# EAGLE design SparkFun_Cypress_USBUART_BOB (EAGLE 7.5.0)
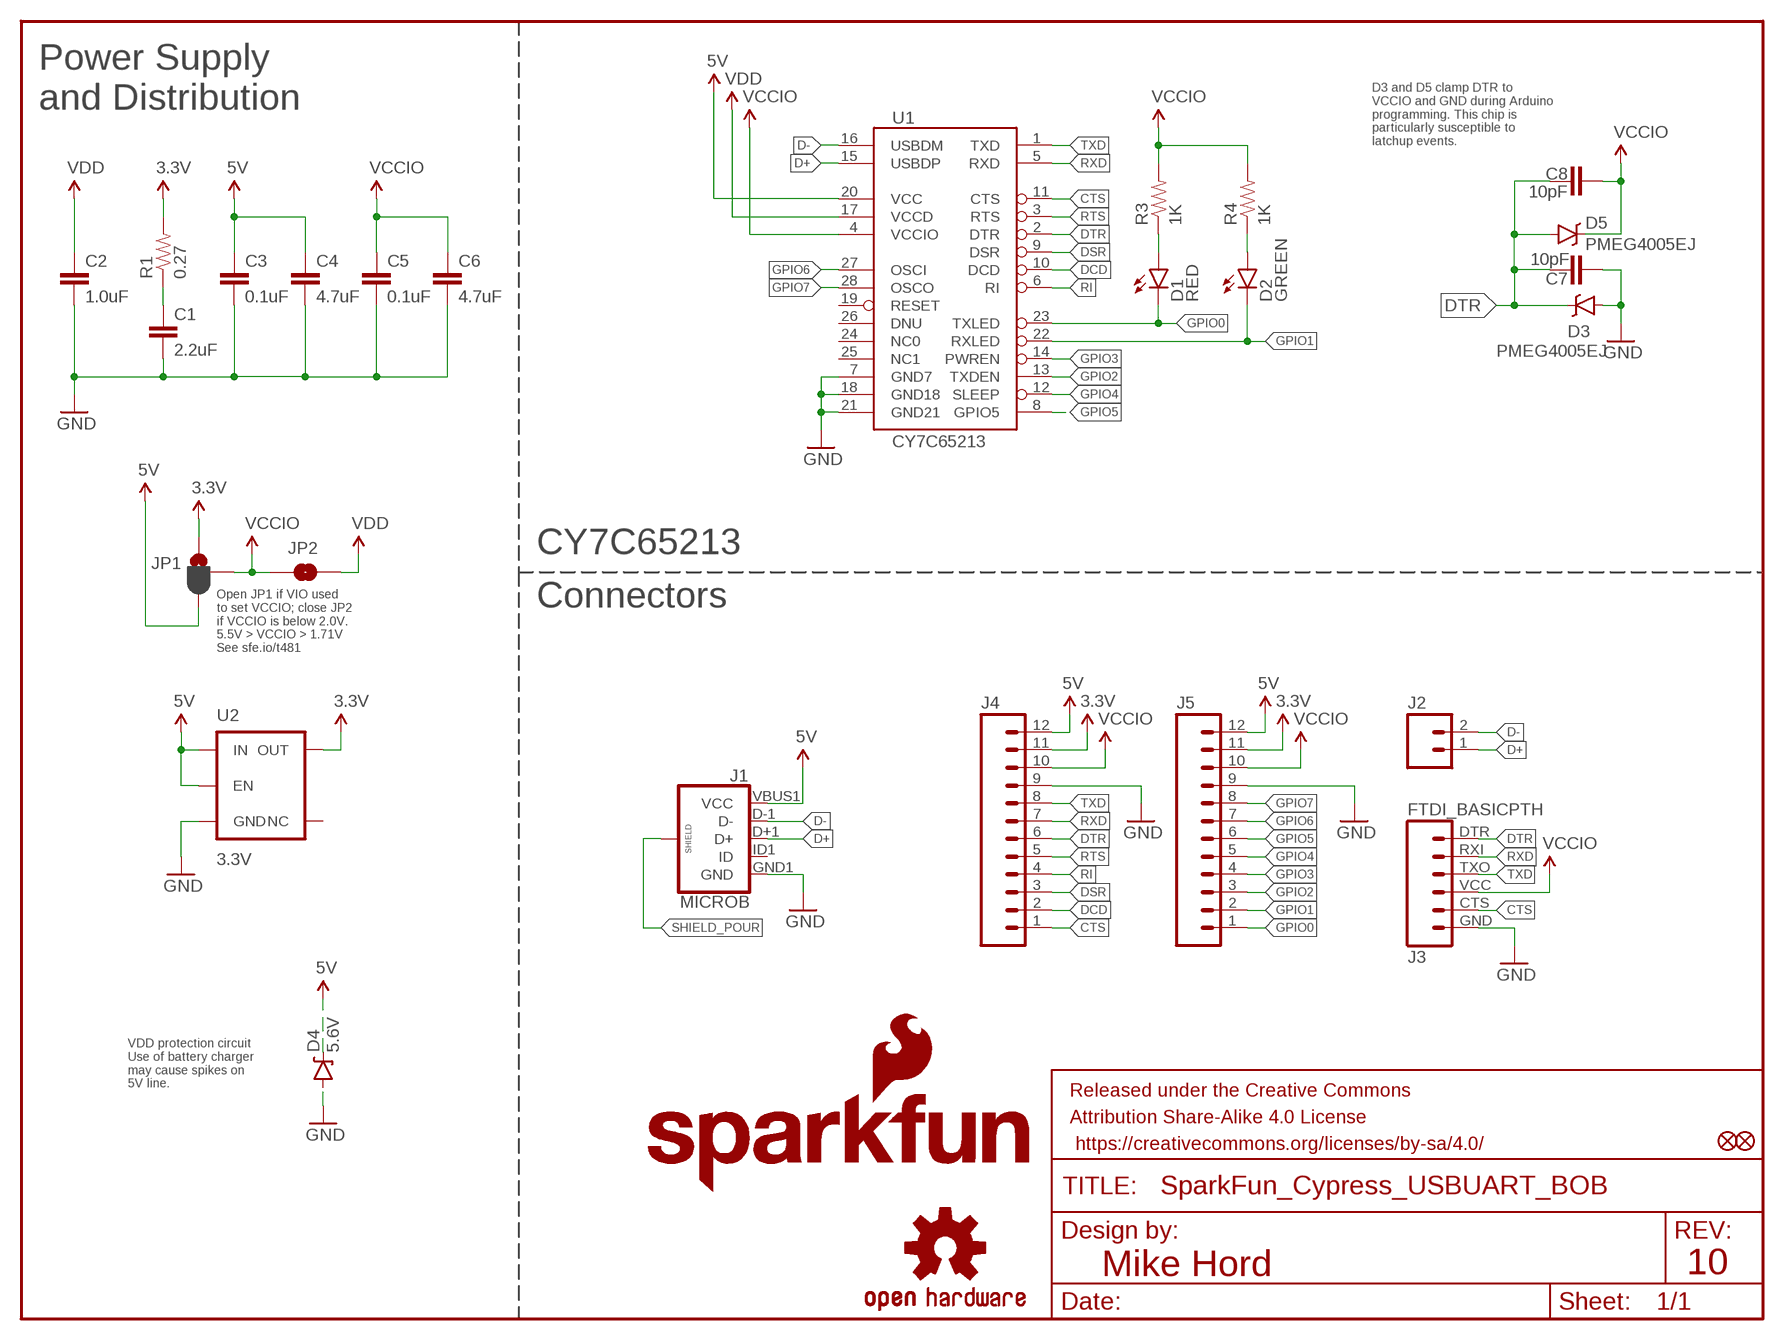
[diagram p0: schematic, sheet 1]

## Parts
C1  2.2uF  2.2UF-10V-20%(0603)  [0603-CAP]
C2  1.0uF  1.0UF-16V-10%(0603)  [0603-CAP]
C3  0.1uF  0.1UF-25V-5%(0603)  [0603-CAP]
C4  4.7uF  4.7UF-16V-20%,+80%-(1206)  [1206-CAP]
C5  0.1uF  0.1UF-25V-5%(0603)  [0603-CAP]
C6  4.7uF  4.7UF-16V-20%,+80%-(1206)  [1206-CAP]
C7  10pF  10PF-50V-5%(0603)  [0603-CAP]
C8  10pF  10PF-50V-5%(0603)  [0603-CAP]
D1  RED  LED-RED0603  [LED-0603]
D2  GREEN  LED-GREEN0603  [LED-0603]
D3  PMEG4005EJ  DIODE-SCHOTTKY-PMEG4005EJ  [SOD-323]
D4  5.6V  DIODE-ZENER5.6V  [SOD-323]
D5  PMEG4005EJ  DIODE-SCHOTTKY-PMEG4005EJ  [SOD-323]
FD1  FIDUCIALUFIDUCIAL  [MICRO-FIDUCIAL]
FD2  FIDUCIALUFIDUCIAL  [MICRO-FIDUCIAL]
FRAME1  FRAME-LETTER  [CREATIVE_COMMONS]
J1  MICROB  USB_MICROB_PLUGCONN-11752  [USB-B-MICRO-SMD_V03]
J2  M02PTH  [1X02]
J3  FTDI_BASICPTH  [FTDI_BASIC]
J4  M12PTH  [1X12]
J5  M12PTH  [1X12]
JP1  JUMPER-PAD-3-2OF3_NC_BY_PASTE  [PAD-JUMPER-3-2OF3_NC_BY_PASTE_YES_SILK_FULL_BOX]
JP2  JUMPER-PAD-2-NOYES_SILK  [PAD-JUMPER-2-NO_YES_SILK]
LOGO1  SFE_LOGO_NAME_FLAME.1_INCH  [SFE_LOGO_NAME_FLAME_.1]
LOGO2  OSHW-LOGOS  [OSHW-LOGO-S]
R1  0.27  0.27OHM-1/10W-1%(0603)  [0603-RES]
R3  1K  1KOHM-1/10W-1%(0603)  [0603-RES]
R4  1K  1KOHM-1/10W-1%(0603)  [0603-RES]
U1  CY7C65213  [SSOP28DB]
U2  3.3V  V_REG_AP2112K-3.3V  [SOT23-5]

## Nets
3.3V: J4.11 J5.11 JP1.1 R1.2 U2.5(OUT)
5V: C3.1 C4.1 D4.C J1.VBUS1(VCC) J4.12 J5.12 JP1.3 U1.20(VCC) U2.1(IN) U2.3(EN)
CTS: J3.CTS J4.1 U1.11(CTS)
D+: J1.D+1(D+) J2.1 U1.15(USBDP)
D-: J1.D-1(D-) J2.2 U1.16(USBDM)
DCD: J4.2 U1.10(DCD)
DSR: J4.3 U1.9(DSR)
DTR: C7.1 C8.1 D3.C D5.A J3.DTR J4.6 U1.2(DTR)
GND: C1.2 C2.2 C3.2 C4.2 C5.2 C6.2 C7.2 D3.A D4.A J1.GND1(GND) J3.GND J4.9 J5.9 U1.7(GND7) U1.18(GND18) U1.21(GND21) U2.2(GND)
GPIO0: D1.C J5.1 U1.23(TXLED)
GPIO1: D2.C J5.2 U1.22(RXLED)
GPIO2: J5.3 U1.13(TXDEN)
GPIO3: J5.4 U1.14(PWREN)
GPIO4: J5.5 U1.12(SLEEP)
GPIO5: J5.6 U1.8(GPIO5)
GPIO6: J5.7 U1.27(OSCI)
GPIO7: J5.8 U1.28(OSCO)
N$1: C1.1 R1.1
N$2: D2.A R4.1
N$3: D1.A R3.1
RI: J4.4 U1.6(RI)
RTS: J4.5 U1.3(RTS)
RXD: J3.RXI J4.7 U1.5(RXD)
SHIELD_POUR: J1.SHIELD1(SHIELD) J1.SHIELD2(SHIELD) J1.SHIELD3(SHIELD)
TXD: J3.TXO J4.8 U1.1(TXD)
VCCIO: C5.1 C6.1 C8.2 D5.C J3.VCC J4.10 J5.10 JP1.2 JP2.1 R3.2 R4.2 U1.4(VCCIO)
VDD: C2.1 JP2.2 U1.17(VCCD)
Unconnected: J1.ID1(ID) U1.19(RESET) U1.24(NC0) U1.26(DNU) U2.4(NC)

## Notes on the sheet
- Power Supply
  and Distribution
- D3 and D5 clamp DTR to
  VCCIO and GND during Arduino
  programming. This chip is
  particularly susceptible to
  latchup events.
- CY7C65213
- Connectors
- Open JP1 if VIO used 
  to set VCCIO; close JP2
  if VCCIO is below 2.0V.
  5.5V > VCCIO > 1.71V
  See sfe.io/t481
- VDD protection circuit
  Use of battery charger
  may cause spikes on 
  5V line.
- Mike Hord | 10

## Power pins joined to a net without a drawn wire
NC1: U1.25(NC1)

## Library data of the parts
C1 = SparkFun-Capacitors:2.2UF-10V-20%(0603): CAP-07888; PROD_ID: CAP-07888
C2 = SparkFun-Capacitors:1.0UF-16V-10%(0603): CAP-00868; PROD_ID: CAP-00868
C3 C5 = SparkFun-Capacitors:0.1UF-25V-5%(0603): CAP-08604; PROD_ID: CAP-08604
C4 C6 = SparkFun-Capacitors:4.7UF-16V-20%,+80%-(1206): CAP-10300; PROD_ID: CAP-10300
C7 C8 = SparkFun-Capacitors:10PF-50V-5%(0603): CAP-11812; PROD_ID: CAP-11812
D1 = SparkFun-LED:LED-RED: Assorted Red LEDs LilyPad 1206- DIO-09912 1206- DIO-00809 0603- DIO-00819 "SMART" means more efficient and expensive; PROD_ID: DIO-00819
D2 = SparkFun-LED:LED-GREEN: Various green LEDs Green LEDs used in SFE Production 0603- DIO-00821 LARGE- DIO-00862 LILYPAD- DIO-09910; PROD_ID: DIO-00821
D3 D5 = SparkFun-DiscreteSemi:DIODE-SCHOTTKY: Schottky diodes in SFE's production catalog BAT20J 1A 23V 0.62Vf RB751 120mA 40V 0.37Vf PMEG4005EJ 0.5A 40V 0.42Vf MBRA140 1A 40V 0.5Vf B340A 3A 40V SMA; PROD_ID: DIO-10955
D4 = SparkFun-DiscreteSemi:DIODE-ZENER: Zener Diode Production Part - 8199 3.4V Zener Voltage; PROD_ID: DIO-12442
FD1 FD2 = SparkFun-Aesthetics:FIDUCIAL: Fiducial Alignment Points Various fiducial points for machine vision alignment.
FRAME1 = SparkFun-Aesthetics:FRAME-LETTER: Schematic Frame Standard 8.5x11 US Letter frame
J1 = SparkFun-Connectors:USB_MICROB_PLUG: USB Micro-B connectors Some male, some female. Watch your step!; PROD_ID: CONN-11752
J2 = SparkFun-Connectors:M02: Standard 2-pin 0.1" header. Use with - straight break away headers ( PRT-00116) - right angle break away headers (PRT-00553) - swiss pins (PRT-00743) - machine pins (PRT-00117) - female headers (PRT-00115) Molex polarized connector foot print use with: PRT-08233 with associated crimp pins and housings. 2.54_SCREWTERM for use with PRT-10571. 3.5mm Screw Terminal footprints for PRT-08084 5mm Screw Terminal footprints for use with PRT-08432
J3 = SparkFun-Connectors:FTDI_BASIC: FTDI Basic header with labels
J4 J5 = SparkFun-Connectors:M12: Header 12 Standard 12-pin 0.1" header. Use with straight break away headers (SKU : PRT-00116), right angle break away headers (PRT-00553), swiss pins (PRT-00743), machine pins (PRT-00117), and female headers (PRT-00115).
JP1 = SparkFun-Passives:JUMPER-PAD-3-2OF3_NC_BY_PASTE
JP2 = SparkFun-Passives:JUMPER-PAD-2-NO
LOGO1 = SparkFun-Aesthetics:SFE_LOGO_NAME_FLAME: SFE Logo, name and flame This is the SparkFun full logo. The logo on the schematic will always be the same size; the package variant is the height of the flame part of the logo. Default layer for the logo on the board is tSilk.
LOGO2 = SparkFun-Aesthetics:OSHW-LOGO: Open Source Hardware Logo This logo indicates the piece of hardware it is found on incorporates a OSHW license and/or adheres to the definition of open source hardware found here: http://freedomdefined.org/OSHW
R1 = SparkFun-Resistors:0.27OHM-1/10W-1%(0603): RES-08787; PROD_ID: RES-08787
R3 R4 = SparkFun-Resistors:1KOHM-1/10W-1%(0603): RES-07856; PROD_ID: RES-07856
U1 = SparkFun-DigitalIC:CY7C65213: USB UART CY7C65213 USB-UART controller.; PROD_ID: IC-12487
U2 = SparkFun-PowerIC:V_REG_AP2112: AP2112 - 600mA CMOS LDO Regulator w/ Enable The AP2112 is CMOS process low dropout linear regulator with enable function, the regulator delivers a guaranteed 600mA (min.) continuous load current. Features Output Voltage Accuracy: ±1.5% Output Current: 600mA (Min.) Foldback Short Current Protection: 50mA Enable Function to Turn ON/OFF VOUT Low Dropout Voltage (3.3V): 250mV (Typ.) @IOUT=600mA Excellent Load Regulation: 0.2%/A (Typ.) Excellent Line Regulation: 0.02%/V (Typ.) Low Quiescent Current: 55μA (Typ.) Low Standby Current: 0.01μA (Typ.) Low Output Noise: 50μVRMS PSRR: 100Hz -65dB, 1kHz -65dB OTSD Protection Stable with 1.0μF Flexible Cap: Ceramic, Tantalum and Aluminum Electrolytic Operation Temperature Range: -40°C to 85°C ESD: MM 400V, HBM 4000V; PROD_ID: VREG-12457

## Board
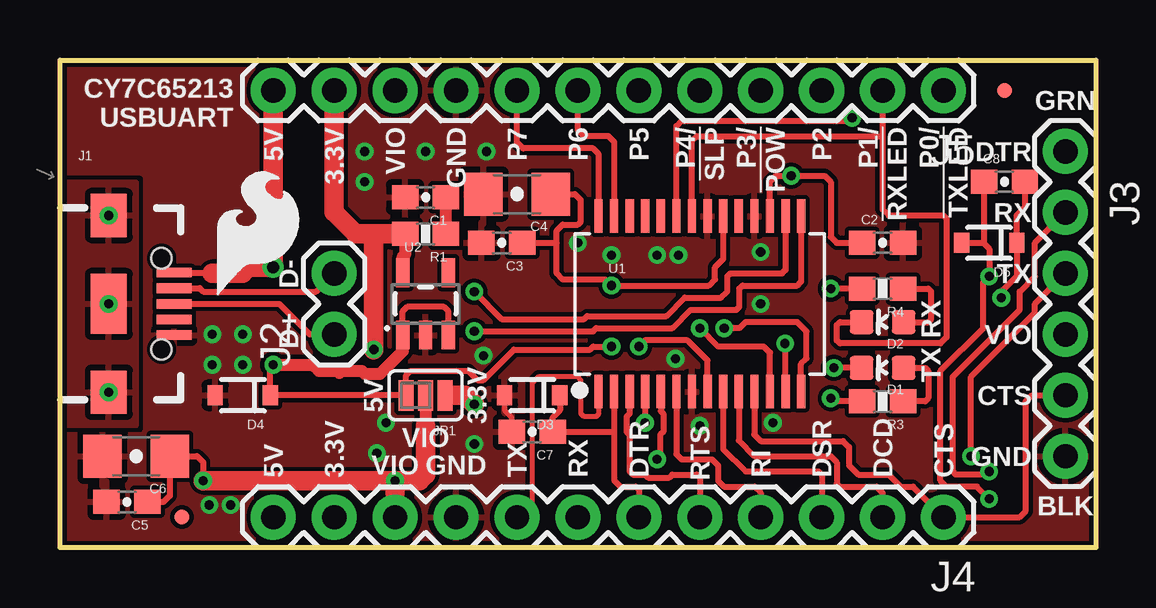
[diagram p1: board, top side]
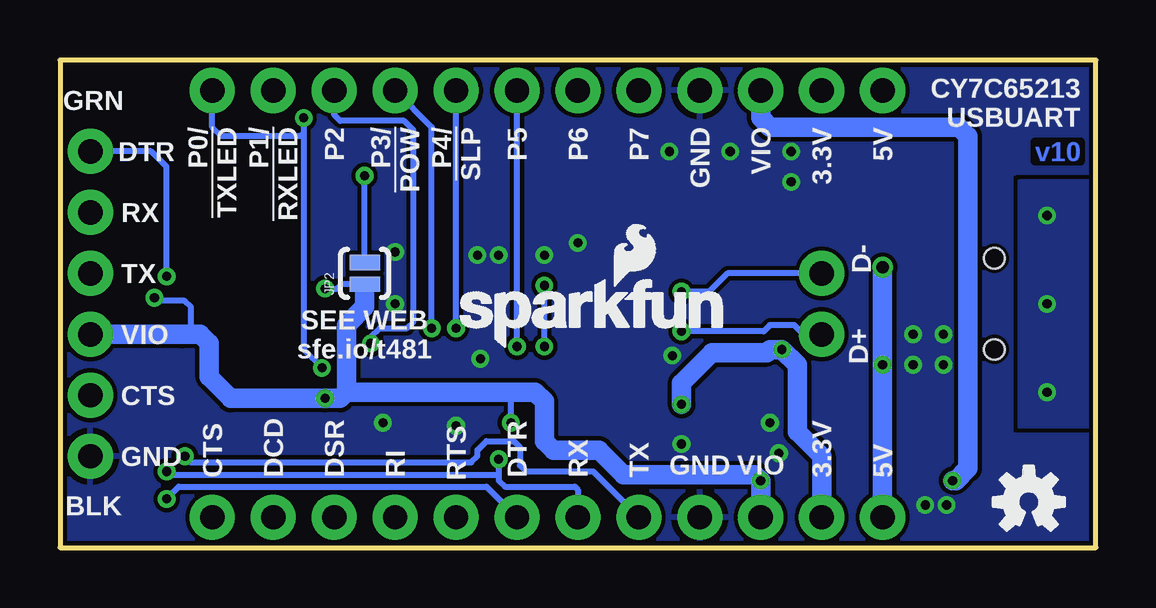
[diagram p2: board, bottom side, seen from below]

Size 43.18 x 20.32 mm. Coordinates in mm from the lower left corner, seen from the top.
Outline: 0,0 0,20.32 43.18,20.32 43.18,0 0,0
Copper layers (1*16): Top 0.035mm / dielectric 1.5mm / Bottom 0.035mm
Design rules "SparkFun-2-layer-TIGHT": minimum track width 7mil, minimum drill 15mil, track to track 7mil, track to pad 7mil, pad to pad 7mil, via to via 7mil, smd to smd 7mil, copper to edge 7mil, drill to drill 7mil, minimum pad ring 7mil, minimum via ring 7mil, stop-mask expansion 4mil, vias tented up to drill 20mil, thermal gap 10mil

### Footprints (pad centres in the part's own frame; a part is rotated, then mirrored left to right if it is on the bottom)
0603-CAP = smd 1.1 x 1: 1 -0.85,0; 2 0.85,0
1206-CAP = smd 1.6 x 1.8: 1 -1.4,0; 2 1.4,0
LED-0603 = smd 1 x 1: A 0,-0.877; C 0,0.877
SOD-323 = smd 0.63 x 0.83: A 1.15,0; C -1.15,0
MICRO-FIDUCIAL = smd 0.635 x 0.635: 1 0,0
USB-B-MICRO-SMD_V03 = smd 1.45 x 0.4: D+1 2.725,0; D-1 2.725,0.65; GND1 2.725,-1.3; ID1 2.725,-0.65; VBUS1 2.725,1.3 | smd 1.5 x 1.8: SHIELD1 0,3.685; SHIELD2 0,-3.685 | smd 1.5 x 2.5: SHIELD3 0,0 | hole 0.85: 2.2,1.9; 2.2,-1.9
1X02 = drill 1.016 pad 1.88: 1 0,0; 2 2.54,0
FTDI_BASIC = drill 1.016 pad 1.88: CTS 10.16,0; DTR 0,0; GND 12.7,0; RXI 2.54,0; TXO 5.08,0; VCC 7.62,0
1X12 = drill 1.016 pad 1.88: 1 0,0; 2 2.54,0; 3 5.08,0; 4 7.62,0; 5 10.16,0; 6 12.7,0; 7 15.24,0; 8 17.78,0; 9 20.32,0; 10 22.86,0; 11 25.4,0; 12 27.94,0
PAD-JUMPER-3-2OF3_NC_BY_PASTE_YES_SILK_FULL_BOX = smd 0.635 x 1.27: 1 -0.813,0; 2 0,0; 3 0.813,0
PAD-JUMPER-2-NO_YES_SILK = smd 0.635 x 1.27: 1 -0.45,0; 2 0.45,0
0603-RES = smd 1.1 x 1: 1 -0.85,0; 2 0.85,0
SSOP28DB = smd 0.348 x 1.397: 1 -4.225,-3.656; 2 -3.575,-3.656; 3 -2.925,-3.656; 4 -2.275,-3.656; 5 -1.625,-3.656; 6 -0.975,-3.656; 7 -0.325,-3.656; 8 0.325,-3.656; 9 0.975,-3.656; 10 1.625,-3.656; 11 2.275,-3.656; 12 2.925,-3.656; 13 3.575,-3.656; 14 4.225,-3.656; 15 4.225,3.656; 16 3.575,3.656; 17 2.925,3.656; 18 2.275,3.656; 19 1.625,3.656; 20 0.975,3.656; 21 0.325,3.656; 22 -0.325,3.656; 23 -0.975,3.656; 24 -1.625,3.656; 25 -2.275,3.656; 26 -2.925,3.656; 27 -3.575,3.656; 28 -4.225,3.656
SOT23-5 = smd 0.55 x 1.2: 1 -0.95,-1.3; 2 0,-1.3; 3 0.95,-1.3; 4 0.95,1.3; 5 -0.95,1.3

### Placement (x,y rotation side)
C1  15.24,14.61 180 top
C2  34.29,12.7 0 top
C3  18.41,12.7 180 top
C4  19.05,14.73 180 top
C5  2.79,1.91 180 top
C6  3.17,3.81 180 top
C7  19.68,4.83 180 top
C8  39.37,15.24 0 top
D1  34.29,7.49 90 top
D2  34.29,9.4 90 top
D3  19.68,6.35 180 top
D4  7.62,6.35 180 top
D5  38.73,12.7 180 top
FD1  5.08,1.27 0 top
FD2  39.37,19.05 0 top
FRAME1  24.13,-17.78 0 top  (outside the outline)
J1  2.03,10.16 0 top
J2  11.43,8.89 90 top
J3  41.91,16.51 270 top
J4  36.83,1.27 180 top
J5  36.83,19.05 180 top
JP1  15.24,6.35 180 top
JP2  30.48,11.43 90 bottom
LOGO1  26.92,8.26 0 bottom
LOGO2  2.79,1.91 0 bottom
LOGO5  SFE_LOGO_FLAME.2_INCH  [SFE_LOGO_FLAME_.2]  6.22,10.29 0 top
R1  15.24,13.08 180 top
R3  34.29,6.1 180 top
R4  34.29,10.79 180 top
U1  26.67,10.16 0 top
U2  15.24,10.16 0 top

### Tracks (layer width: path | path; a pad name or v marks a point on that pad's centre or on a via)
3.3V  (via drill 0.38)
  Top 0.508: JP1.1 16.38,6.35 | U2.5 14.29,12.13 14.39,12.23 R1.2 13.84,13.08
  Top 0.813: 16.38,6.35 16.89,6.35 v17.27,5.97 | v13.08,8.26 13.08,13.08 | J5.11 11.43,13.97 12.32,13.08 13.08,13.08 | 13.84,13.08 13.08,13.08
  Bottom 0.813: v17.27,5.97 17.27,6.86 16,8.13 13.72,8.13 13.59,8.26 v13.08,8.26 12.45,7.62 12.45,4.83 11.43,3.81 J4.11
5V  (via drill 0.38, 0.51)
  Top 0.254: J1.VBUS1 6.32,11.46 6.35,11.43 | U2.3 16.19,9.85 16,10.03 14.48,10.03 14.29,9.85 U2.1 | v22.99,8.38 22.23,8.38 22.1,8.26 18.92,8.26 17.65,6.99 17.4,6.99 17.02,7.37 14.61,7.37 14.43,7.19 JP1.3 D4.C 8.77,7.5 v8.89,7.62 | 20.7,12.7 20.7,11.43 20.96,11.17 22.74,11.17 v22.99,10.92 27.05,10.92 27.3,11.18 27.3,11.68 27.64,12.02 U1.20 | 20.7,12.7 20.7,13.21 20.95,13.46 21.59,13.46 21.72,13.59 21.72,14.48 21.46,14.73 C4.1 | C3.1 20.7,12.7
  Top 0.508: v8.89,7.62 10.54,7.62 10.79,7.37 11.56,7.37 | 11.56,7.37 12.57,7.37 12.7,7.24 13.34,7.24 14.29,8.19 U2.1 | 11.64,7.28 11.56,7.37
  Top 0.813: J5.12 v8.89,11.68 7.87,11.68 7.62,11.43 6.35,11.43
  Bottom 0.254: v22.99,8.38 v22.99,10.92
  Bottom 0.813: v8.89,11.68 v8.89,7.62 J4.12
CTS
  Top 0.254: U1.11 28.95,4.71 29.21,4.45 32.64,4.45 32.89,4.19 32.89,3.43 33.27,3.05 34.54,3.05 35.05,2.54 35.56,2.54 J4.1 40.01,1.27 40.26,1.52 40.26,6.1 40.51,6.35 J3.CTS
D+  (via drill 0.38)
  Top 0.254: J1.D+1 9.14,10.16 10.41,8.89 J2.1 | v17.27,9.02 22.23,9.02 22.35,9.14 25.53,9.14 26.29,9.91 28.19,9.91 28.32,10.03 28.32,10.79 28.45,10.92 30.73,10.92 30.89,11.08 U1.15
  Bottom 0.254: J2.1 12.19,8.89 12.57,9.27 13.59,9.27 13.84,9.02 v17.27,9.02
D-  (via drill 0.38)
  Top 0.254: J1.D-1 5.83,10.81 5.97,10.67 10.67,10.67 J2.2 | v17.27,10.67 18.41,9.53 21.84,9.53 21.97,9.65 25.27,9.65 26.04,10.41 27.56,10.41 27.81,10.67 27.81,11.3 27.94,11.43 30.1,11.43 30.25,11.58 U1.16
  Bottom 0.254: J2.2 15.37,11.43 16.13,10.67 v17.27,10.67
DCD
  Top 0.254: U1.10 28.3,4.47 28.96,3.81 32.13,3.81 32.38,3.56 32.38,2.67 32.51,2.54 34.04,2.54 34.29,2.29 J4.2
DSR
  Top 0.254: U1.9 27.64,4.11 28.57,3.17 31.62,3.17 31.75,3.05 J4.3
DTR  (via drill 0.38)
  Top 0.254: U1.2 23.09,4.83 | 23.09,4.83 23.09,2.81 23.37,2.54 24,2.54 24.13,2.41 J4.6 | v38.73,2.03 38.23,2.54 36.96,2.54 36.7,2.79 36.7,7.37 38.48,9.14 38.48,11.05 v38.73,11.3 38.73,12.45 38.48,12.7 | 23.09,4.83 C7.1 20.54,5.42 20.84,5.72 D3.C | D5.A 38.48,12.7 | C8.1 38.52,12.74 38.48,12.7
  Bottom 0.254: J4.6 25.4,2.54 38.23,2.54 v38.73,2.03 | v38.73,11.3 38.73,15.88 39.37,16.51 J3.DTR
GND  (via drill 0.38)
  Top 0.203: C7.2 18.84,5.42 18.54,5.71 18.54,6.22
  other vias: 6.35,8.89 6.35,7.62 7.62,8.89 7.62,7.62 17.27,4.32 26.67,5.08 29.21,12.32 29.21,10.16 12.7,16.51 17.65,8 13.59,5.21 13.21,3.94 29.72,5.21 25.65,7.87 7.11,1.78 6.22,1.78 12.7,15.24 15.24,16.51 17.78,16.51 21.59,12.7 22.99,12.19 24.89,12.19 25.78,12.19
  pour Bottom (rank 2): 0,20.32 0,0 43.18,0 43.18,20.32
  pour Top (rank 2): 0,20.32 0,0 43.18,0 43.18,20.32
GPIO0  (via drill 0.38)
  Top 0.254: U1.23 25.7,17.57 25.91,17.78 32.89,17.78 v33.02,17.91 | D1.C v32.26,7.49
  Bottom 0.254: J5.1 36.83,17.53 36.45,17.14 33.15,17.14 33.02,17.27 | v33.02,17.91 33.02,17.27 | 33.02,17.27 33.02,8.26 v32.26,7.49
GPIO1
  Top 0.254: U1.22 26.34,16.95 26.54,17.14 34.29,17.14 | J5.2 34.29,17.14 | 34.29,17.14 34.29,14.1 34.54,13.84 36.83,13.84 36.96,13.72 36.96,8.76 36.7,8.51 32.51,8.51 32.38,8.64 32.38,9.27 32.51,9.4 D2.C
GPIO2  (via drill 0.38)
  Top 0.254: U1.13 30.25,8.49 v30.23,8.51
  Bottom 0.254: v30.23,8.51 30.23,8.76 29.84,9.14 28.7,9.14 28.45,9.4 28.45,17.4 28.83,17.78 31.5,17.78 31.75,18.03 J5.3
GPIO3  (via drill 0.38)
  Top 0.254: v27.69,9.14 28.32,9.14 28.57,9.4 30.73,9.4 31.11,9.02 31.11,7.87 30.89,7.65 U1.14
  Bottom 0.254: v27.69,9.14 27.69,17.53 J5.4
GPIO4  (via drill 0.38)
  Top 0.254: U1.12 29.59,8.12 29.34,8.38 27.43,8.38 v26.67,9.14
  Bottom 0.254: v26.67,9.14 J5.5
GPIO5  (via drill 0.38)
  Top 0.254: U1.8 27,7.8 26.16,8.64 24.38,8.64 v24.13,8.38
  Bottom 0.254: v24.13,8.38 J5.6
GPIO6
  Top 0.254: J5.7 21.59,17.4 21.84,17.14 22.86,17.14 23.09,16.91 U1.27
GPIO7
  Top 0.254: J5.8 19.05,16.89 19.3,16.64 22.23,16.64 22.45,16.42 U1.28
N$1
  Top 0.508: R1.1 C1.1
N$2
  Top 0.254: D2.A 36.2,9.4 36.32,9.53 36.32,10.67 36.2,10.79 R4.1
N$3
  Top 0.254: D1.A 36.07,7.49 36.2,7.37 36.2,6.22 36.07,6.1 R3.1
RI
  Top 0.254: U1.6 25.7,3.9 25.91,3.68 27.18,3.68 27.43,3.43 27.43,2.79 27.69,2.54 28.96,2.54 29.21,2.29 J4.4
RTS
  Top 0.254: U1.3 23.75,5.58 23.62,5.46 23.62,4.83 23.75,4.7 23.75,3.18 23.88,3.05 24.38,3.05 24.51,2.92 25.4,2.92 25.53,3.05 26.54,3.05 26.67,2.92 J4.5
RXD  (via drill 0.38)
  Top 0.254: U1.5 25.05,5.69 25.15,5.59 25.15,4.83 25.02,4.7 25.02,3.81 v24.89,3.68 | v38.73,3.17 38.61,3.05 37.34,3.05 37.21,3.17 37.21,7.11 40.01,9.91 40.01,10.67 40.64,11.3 40.64,12.7 J3.RXI
  Bottom 0.254: v24.89,3.68 24.89,3.05 | 24.89,3.05 24.89,2.79 24.64,2.54 21.72,2.54 21.59,2.41 J4.7 | 24.89,3.05 38.61,3.05 v38.73,3.17
SHIELD_POUR  (via drill 0.38)
  other vias: 2.03,6.48 2.03,10.16 2.03,13.84
  pour Bottom: 0,15.24 3.17,15.24 3.17,5.08 0,5.08
  pour Top: 0,15.24 3.17,15.24 3.17,5.08 0,5.08
TXD  (via drill 0.38)
  Top 0.203: U1.1 22.45,5.55 22.35,5.46 21.84,5.46 21.72,5.59 21.72,6.99 21.59,7.11 19.94,7.11 19.68,6.86 19.68,1.91 J4.8
  Top 0.254: v37.97,3.81 37.97,7.11 40.64,9.78 40.64,10.16 J3.TXO
  Bottom 0.254: J4.8 20.95,3.17 23.75,3.17 24,3.43 24,4.19 24.26,4.45 25.4,4.45 25.78,4.06 25.78,3.81 26.04,3.56 37.72,3.56 v37.97,3.81
VCCIO  (via drill 0.38)
  Top 0.254: 15.37,5.21 15.24,5.08 | R4.2 v32.13,10.79 | R3.2 32.26,6.1 v32.13,6.22 | C5.1 4.32,1.91 4.58,2.16 C6.1 | C6.1 4.45,3.68 4.95,3.68 5.08,3.81 | C6.1 5.71,3.81 5.97,3.56 v5.97,2.79 | U1.4 24.39,5.22 v24.38,5.21 | C8.2 40.22,14.19 39.88,13.85 D5.C 39.88,11.31 39.24,10.67 v39.24,10.41
  Top 0.508: JP1.2 15.24,4.57
  Top 0.813: 15.24,5.08 15.24,4.57 15.24,3.05 14.99,2.79 v13.97,2.79 | v5.97,2.79 v13.97,2.79 | v13.97,2.79 13.97,2.29
  Bottom 0.254: v32.13,10.79 31.62,10.79 31.44,10.98 JP2.1 | 38.1,8.89 37.72,9.27 37.72,10.03 37.97,10.29 39.12,10.29 v39.24,10.41 | v24.38,5.21 24.38,6.22 24.13,6.48
  Bottom 0.508: JP2.1 30.48,10.54
  Bottom 0.813: 30.48,10.54 30.48,10.03 31.24,9.27 31.24,6.48 | 31.24,6.48 31.5,6.22 v32.13,6.22 36.07,6.22 36.96,7.11 36.96,8.51 37.34,8.89 38.1,8.89 J3.VCC | J4.10 v13.97,2.79 14.22,3.05 19.68,3.05 20.7,4.06 22.61,4.06 22.99,4.45 22.99,6.1 23.37,6.48 24.13,6.48 31.24,6.48 | J5.10 13.97,17.91 13.59,17.53 5.71,17.53 5.33,17.14 5.33,3.3 5.84,2.79 v5.97,2.79
VDD  (via drill 0.38)
  Top 0.254: U1.17 29.59,15.24 29.84,15.49 v30.48,15.49 31.88,15.49 32.13,15.24 32.13,12.95 32.38,12.7 C2.1
  Bottom 0.254: JP2.2 v30.48,15.49

### Text on the board
Bottom: v10
tPlace: CY7C65213 / USBUART | GRN | 5V | 3.3V | VIO | GND | P7 | P6 | P5 | P4/ / !SLP | P3/ / !POW | P2 | P1/ / !RXLED | P0/ / !TXLED | DTR | RX | D- | TX | D+ | RX | VIO | TX | 5V | 3.3V | CTS | VIO | GND | 5V | 3.3V | VIO | GND | TX | RX | DTR | RTS | RI | DSR | DCD | CTS | BLK
bPlace: CY7C65213 / USBUART | GRN | 5V | 3.3V | VIO | GND | P7 | P6 | P5 | P4/ / !SLP | P3/ / !POW | P2 | P1/ / !RXLED | P0/ / !TXLED | DTR | RX | D- | TX | D+ | SEE WEB / sfe.io/t481 | VIO | CTS | GND | 5V | 3.3V | VIO | GND | TX | RX | DTR | RTS | RI | DSR | DCD | CTS | BLK
tDocu: Mike Hord